# EAGLE schematic DMX (EAGLE 6.1)
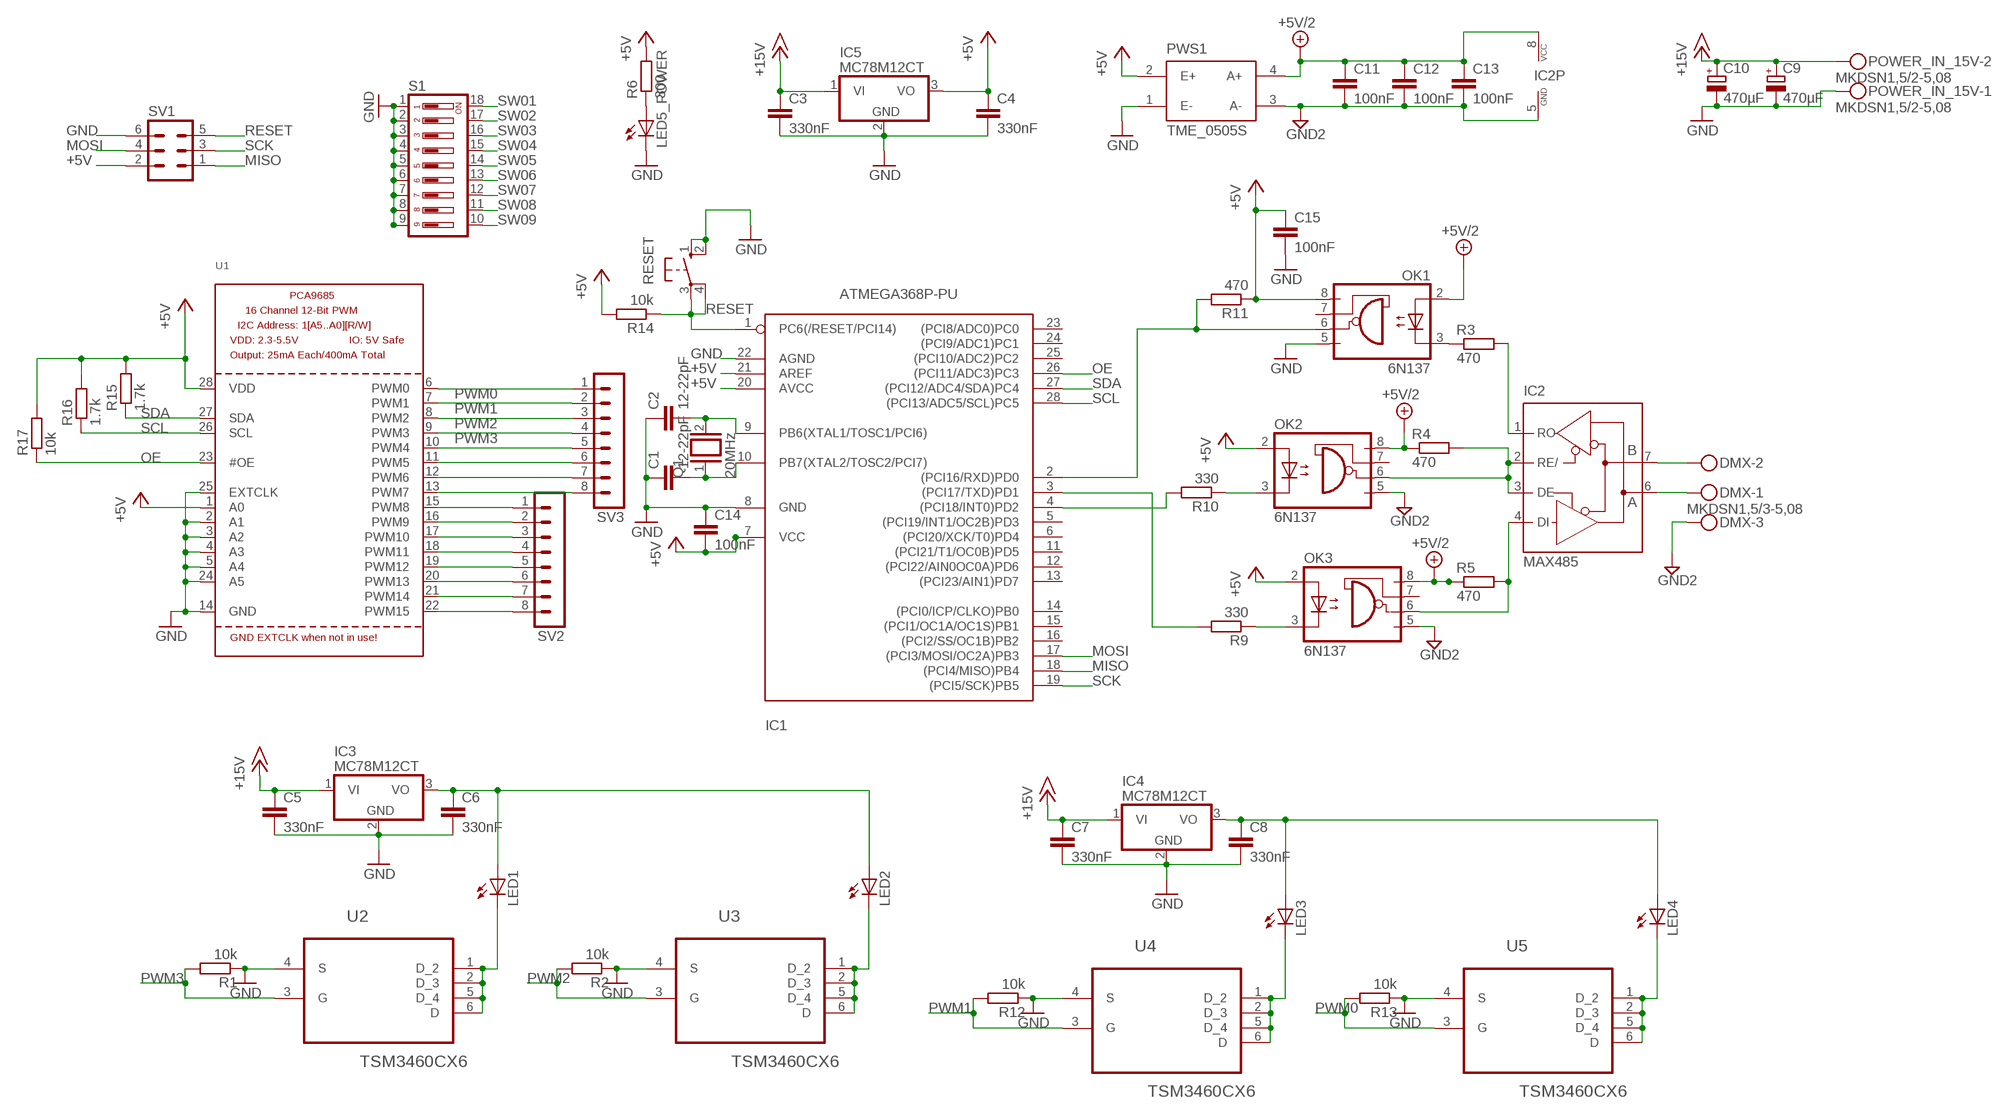
[diagram p0: schematic, sheet 1]

## Parts
C1  12-22pF  C-EU025-025X050  [C025-025X050]
C2  12-22pF  C-EU025-025X050  [C025-025X050]
C3  330nF  C-EU050-025X075  [C050-025X075]
C4  330nF  C-EU050-025X075  [C050-025X075]
C5  330nF  C-EU050-025X075  [C050-025X075]
C6  330nF  C-EU050-025X075  [C050-025X075]
C7  330nF  C-EU050-025X075  [C050-025X075]
C8  330nF  C-EU050-025X075  [C050-025X075]
C9  470µF  CPOL-EUE5-10.5  [E5-10,5]
C10  470µF  CPOL-EUE5-10.5  [E5-10,5]
C11  100nF  C-EU050-025X075  [C050-025X075]
C12  100nF  C-EU050-025X075  [C050-025X075]
C13  100nF  C-EU050-025X075  [C050-025X075]
C14  100nF  C-EU050-025X075  [C050-025X075]
C15  100nF  C-EU050-025X075  [C050-025X075]
DMX  MKDSN1,5/3-5,08  [MKDSN1,5/3-5,08]
IC1  ATMEGA368P-PU  ATMEGA168-20P  [DIL28-3]
IC2  MAX485  MAX481CPA  [DIL08]
IC3  MC78M12CT  [TO220V]
IC4  MC78M12CT  [TO220V]
IC5  MC78M12CT  [TO220V]
LED1  LED5MM  [LED5MM]
LED2  LED5MM  [LED5MM]
LED3  LED5MM  [LED5MM]
LED4  LED5MM  [LED5MM]
LED5_POWER  LED5MM  [LED5MM]
OK1  6N137  [DIL08]
OK2  6N137  [DIL08]
OK3  6N137  [DIL08]
POWER_IN_15V  MKDSN1,5/2-5,08  [MKDSN1,5/2-5,08]
PWS1  TME_0505S  [TMEXXXXS]
Q1  20MHz  XTAL/S  [QS]
R1  10k  R-EU_0207/7  [0207/7]
R2  10k  R-EU_0207/7  [0207/7]
R3  470  R-EU_0207/7  [0207/7]
R4  470  R-EU_0207/7  [0207/7]
R5  470  R-EU_0207/7  [0207/7]
R6  300  R-EU_0204/7  [0204/7]
R9  330  R-EU_0207/7  [0207/7]
R10  330  R-EU_0207/7  [0207/7]
R11  470  R-EU_0207/7  [0207/7]
R12  10k  R-EU_0207/7  [0207/7]
R13  10k  R-EU_0207/7  [0207/7]
R14  10k  R-EU_0204/7  [0204/7]
R15  1.7k  R-EU_0204/7  [0204/7]
R16  1.7k  R-EU_0204/7  [0204/7]
R17  10k  R-EU_0204/7  [0204/7]
RESET  10-XX  [B3F-10XX]
S1  DP09  [DP-09]
SV1  MA03-2  [MA03-2]
SV2  MA08-1  [MA08-1]
SV3  MA08-1  [MA08-1]
U1  PCA9685  [TSSOP28]
U2  TSM3460CX6  [SOT95P280X120-6N]
U3  TSM3460CX6  [SOT95P280X120-6N]
U4  TSM3460CX6  [SOT95P280X120-6N]
U5  TSM3460CX6  [SOT95P280X120-6N]

## Nets
+5V: C4.1 C14.2 C15.1 IC1.7(VCC) IC1.20(AVCC) IC1.21(AREF) IC5.3(VO) OK1.8(VCC) OK2.2(A) OK3.2(A) PWS1.2(E+) R6.2 R11.1 R14.2 R15.2 R16.2 R17.2 SV1.2 U1.1(A0) U1.28(VDD)
+5V/2: C11.1 C12.1 C13.1 IC2.8(VCC) OK1.2(A) OK2.8(VCC) OK3.8(VCC) PWS1.4(A+) R4.1 R5.1
+15V: C3.1 C5.1 C7.1 C9.+ C10.+ IC3.1(VI) IC4.1(VI) IC5.1(VI) POWER_IN_15V.2
GND: C1.1 C2.1 C3.2 C4.2 C5.2 C6.2 C7.2 C8.2 C9.- C10.- C14.1 C15.2 IC1.8(GND) IC1.22(AGND) IC3.2(GND) IC4.2(GND) IC5.2(GND) LED5_POWER.K(C) OK1.5(GND) POWER_IN_15V.1 PWS1.1(E-) R1.1 R2.1 R12.1 R13.1 RESET.1(S) RESET.2(S1) S1.1 S1.2 S1.3 S1.4 S1.5 S1.6 S1.7 S1.8 S1.9 SV1.6 U1.2(A1) U1.3(A2) U1.4(A3) U1.5(A4) U1.14(GND) U1.24(A5) U1.25(EXTCLK) U2.4(S) U3.4(S) U4.4(S) U5.4(S)
GND2: C11.2 C12.2 C13.2 DMX.3 IC2.5(GND) OK2.5(GND) OK3.5(GND) PWS1.3(A-)
MISO: IC1.18((PCI4/MISO)PB4) SV1.1
MOSI: IC1.17((PCI3/MOSI/OC2A)PB3) SV1.4
N$1: OK1.3(C) R3.1
N$2: IC2.1(RO) R3.2
N$3: IC2.2(RE/) IC2.3(DE) OK2.6(VO) R4.2
N$4: IC2.4(DI) OK3.6(VO) R5.2
N$5: OK3.3(C) R9.1
N$6: OK2.3(C) R10.1
N$7: IC1.2((PCI16/RXD)PD0) OK1.6(VO) R11.2
N$8: IC1.4((PCI18/INT0)PD2) R10.2
N$9: IC1.3((PCI17/TXD)PD1) R9.2
N$10: DMX.2 IC2.7(B)
N$11: DMX.1 IC2.6(A)
N$12: C6.1 IC3.3(VO) LED1.A LED2.A
N$13: LED3.K(C) U4.1(D_2) U4.2(D_3) U4.5(D_4) U4.6(D)
N$14: C8.1 IC4.3(VO) LED3.A LED4.A
N$15: LED1.K(C) U2.1(D_2) U2.2(D_3) U2.5(D_4) U2.6(D)
N$16: LED4.K(C) U5.1(D_2) U5.2(D_3) U5.5(D_4) U5.6(D)
N$17: LED2.K(C) U3.1(D_2) U3.2(D_3) U3.5(D_4) U3.6(D)
N$18: C1.2 IC1.10(PB7(XTAL2/TOSC2/PCI7)) Q1.1
N$19: C2.2 IC1.9(PB6(XTAL1/TOSC1/PCI6)) Q1.2
N$20: LED5_POWER.A R6.1
N$22: SV3.5 U1.10(PWM4)
N$23: SV3.6 U1.11(PWM5)
N$24: SV3.7 U1.12(PWM6)
N$25: SV3.8 U1.13(PWM7)
N$26: SV2.1 U1.15(PWM8)
N$27: SV2.2 U1.16(PWM9)
N$28: SV2.3 U1.17(PWM10)
N$29: SV2.4 U1.18(PWM11)
N$30: SV2.5 U1.19(PWM12)
N$31: SV2.6 U1.20(PWM13)
N$32: SV2.7 U1.21(PWM14)
N$33: SV2.8 U1.22(PWM15)
OE: IC1.26((PCI11/ADC3)PC3) R17.1 U1.23(#OE)
PWM0: R13.2 SV3.1 U1.6(PWM0) U5.3(G)
PWM1: R12.2 SV3.2 U1.7(PWM1) U4.3(G)
PWM2: R2.2 SV3.3 U1.8(PWM2) U3.3(G)
PWM3: R1.2 SV3.4 U1.9(PWM3) U2.3(G)
RESET: IC1.1(PC6(/RESET/PCI14)) R14.1 RESET.3(P) RESET.4(P1) SV1.5
SCK: IC1.19((PCI5/SCK)PB5) SV1.3
SCL: IC1.28((PCI13/ADC5/SCL)PC5) R16.1 U1.26(SCL)
SDA: IC1.27((PCI12/ADC4/SDA)PC4) R15.1 U1.27(SDA)
SW01: S1.18
SW02: S1.17
SW03: S1.16
SW04: S1.15
SW05: S1.14
SW06: S1.13
SW07: S1.12
SW08: S1.11
SW09: S1.10
Unconnected: IC1.5((PCI19/INT1/OC2B)PD3) IC1.6((PCI20/XCK/T0)PD4) IC1.11((PCI21/T1/OC0B)PD5) IC1.12((PCI22/AIN0OC0A)PD6) IC1.13((PCI23/AIN1)PD7) IC1.14((PCI0/ICP/CLKO)PB0) IC1.15((PCI1/OC1A/OC1S)PB1) IC1.16((PCI2/SS/OC1B)PB2) IC1.23((PCI8/ADC0)PC0) IC1.24((PCI9/ADC1)PC1) IC1.25((PCI10/ADC2)PC2) OK1.7(VE) OK2.7(VE) OK3.7(VE)

## Library data of the parts
C1-C8 C11-C15 = rcl:C-EU: CAPACITOR, European symbol
C9 C10 = rcl:CPOL-EU: POLARIZED CAPACITOR, European symbol
DMX = con-phoenix-508:MKDSN1,5/3-5,08: MKDSN 1,5/ 3-5,08 Printklemme Nennstrom: 13,5 A Nennspannung: 250 V Rastermaß: 5,08 mm Polzahl: 3 Anschlussart: Schraubanschluss Montage: Löten Anschlussrichtung Leiter/Platine: 0 ° Artikelnummer: 1729131 Source: http://eshop.phoenixcontact.com .. 1729131.pdf; MPN: SMKDSN1,5/3-5,08; OC_FARNELL: 1792904; OC_NEWARK: 70R0299
IC1 = adafruit:ATMEGA168*P: MICROCONTROLLER 16 kBytes FLASH 1 kBytes SRAM 512 Bytes EEPROM USART 8-channel 10 bit ADC
IC2 = maxim:MAX481CPA: RS485 TRANSEIVER; MPN: MAX485; OC_FARNELL: unknown; OC_NEWARK: 99K3445
IC3-IC5 = linear:MC78M: 500 mA Positive Voltage Regulators Source: Data sheet <http://www.onsemi.com/pub_link/Collateral/MC78M00-D.PDF>
LED1-LED4 LED5_POWER = led:LED: LED OSRAM: - CHIPLED LG R971, LG N971, LY N971, LG Q971, LY Q971, LO R971, LY R971 LH N974, LH R974 LS Q976, LO Q976, LY Q976 LO Q996 - Hyper CHIPLED LW Q18S LB Q993, LB Q99A, LB R99A - SideLED LS A670, LO A670, LY A670, LG A670, LP A670 LB A673, LV A673, LT A673, LW A673 LH A674 LY A675 LS A676, LA A676, LO A676, LY A676, LW A676 LS A679, LY A679, LG A679 - Hyper Micro SIDELED® LS Y876, LA Y876, LO Y876, LY Y876 LT Y87S - SmartLED LW L88C, LW L88S LB L89C, LB L89S, LG L890 LS L89K, LO L89K, LY L89K LS L896, LA L896, LO L896, LY L896 - TOPLED LS T670, LO T670, LY T670, LG T670, LP T670 LSG T670, LSP T670, LSY T670, LOP T670, LYG T670 LG T671, LOG T671, LSG T671 LB T673, LV T673, LT T673, LW T673 LH T674 LS T676, LA T676, LO T676, LY T676, LB T676, LH T676, LSB T676, LW T676 LB T67C, LV T67C, LT T67C, LS T67K, LO T67K, LY T67K, LW E67C LS E67B, LA E67B, LO E67B, LY E67B, LB E67C, LV E67C, LT E67C LW T67C LS T679, LY T679, LG T679 LS T770, LO T770, LY T770, LG T770, LP T770 LB T773, LV T773, LT T773, LW T773 LH T774 LS E675, LA E675, LY E675, LS T675 LS T776, LA T776, LO T776, LY T776, LB T776 LHGB T686 LT T68C, LB T68C - Hyper Mini TOPLED® LB M676 - Mini TOPLED Santana® LG M470 LS M47K, LO M47K, LY M47K Source: http://www.osram.convergy.de LUXEON: - LUMILED® LXK2-PW12-R00, LXK2-PW12-S00, LXK2-PW14-U00, LXK2-PW14-V00 LXK2-PM12-R00, LXK2-PM12-S00, LXK2-PM14-U00 LXK2-PE12-Q00, LXK2-PE12-R00, LXK2-PE12-S00, LXK2-PE14-T00, LXK2-PE14-U00 LXK2-PB12-K00, LXK2-PB12-L00, LXK2-PB12-M00, LXK2-PB14-N00, LXK2-PB14-P00, LXK2-PB14-Q00 LXK2-PR12-L00, LXK2-PR12-M00, LXK2-PR14-Q00, LXK2-PR14-R00 LXK2-PD12-Q00, LXK2-PD12-R00, LXK2-PD12-S00 LXK2-PH12-R00, LXK2-PH12-S00 LXK2-PL12-P00, LXK2-PL12-Q00, LXK2-PL12-R00 Source: www.luxeon.com KINGBRIGHT: KA-3528ASYC Source: www.kingbright.com
OK1-OK3 = optocoupler:6N137: MOTOROLA OPTO COUPLER; MPN: 6N137; OC_FARNELL: 1328376; OC_NEWARK: 52M1895
POWER_IN_15V = con-phoenix-508:MKDSN1,5/2-5,08: MKDSN 1,5/ 2-5,08 Printklemme Nennstrom: 13,5 A Nennspannung: 250 V Rastermaß: 5,08 mm Polzahl: 2 Anschlussart: Schraubanschluss Montage: Löten Anschlussrichtung Leiter/Platine: 0 ° Artikelnummer: 1729128 Source: http://eshop.phoenixcontact.com .. 1729128.pdf; MPN: MKDSN 1,5/2-5.08; OC_FARNELL: 1792903; OC_NEWARK: 30M2397
PWS1 = traco-electronic:TME_*S: DC/DC Konverter 1 Watt Source: http://www.tracopower.com/datasheet_g/tme-d.pdf; MPN: TME 0505S; OC_FARNELL: 1007538; OC_NEWARK: 51R5321
Q1 = special:XTAL/S: CRYSTAL
R1-R6 R9-R17 = rcl:R-EU_: RESISTOR, European symbol
RESET = switch-omron:10-XX: OMRON SWITCH; MPN: B3F-1000; OC_FARNELL: 176432; OC_NEWARK: 36M3542
S1 = switch-dil:DP09: DIL/CODE SWITCH; MPN: MCDP09; OC_FARNELL: 1522007; OC_NEWARK: 74M2979
SV1 = con-lstb:MA03-2: PIN HEADER; OC_FARNELL: unknown; OC_NEWARK: unknown
SV2 SV3 = con-lstb:MA08-1: PIN HEADER; OC_FARNELL: unknown; OC_NEWARK: unknown
U1 = adafruit:PCA9685: PCA9685 - 16 Channel 12-Bit I2C PWM Controller 5.0V tolerant 16 channel, 12-bit I2C PWM controller with 25mA per output (max. 400mA total) Digikey: 568-5931-1-ND
U2-U5 = farnell:TSM3460CX6: N-Channel MOSFET; MPN: TSM3460CX6; OC_FARNELL: 1864595; OC_NEWARK: 27T3007; PACKAGE: SOT-6; SUPPLIER: Taiwan Semiconductors